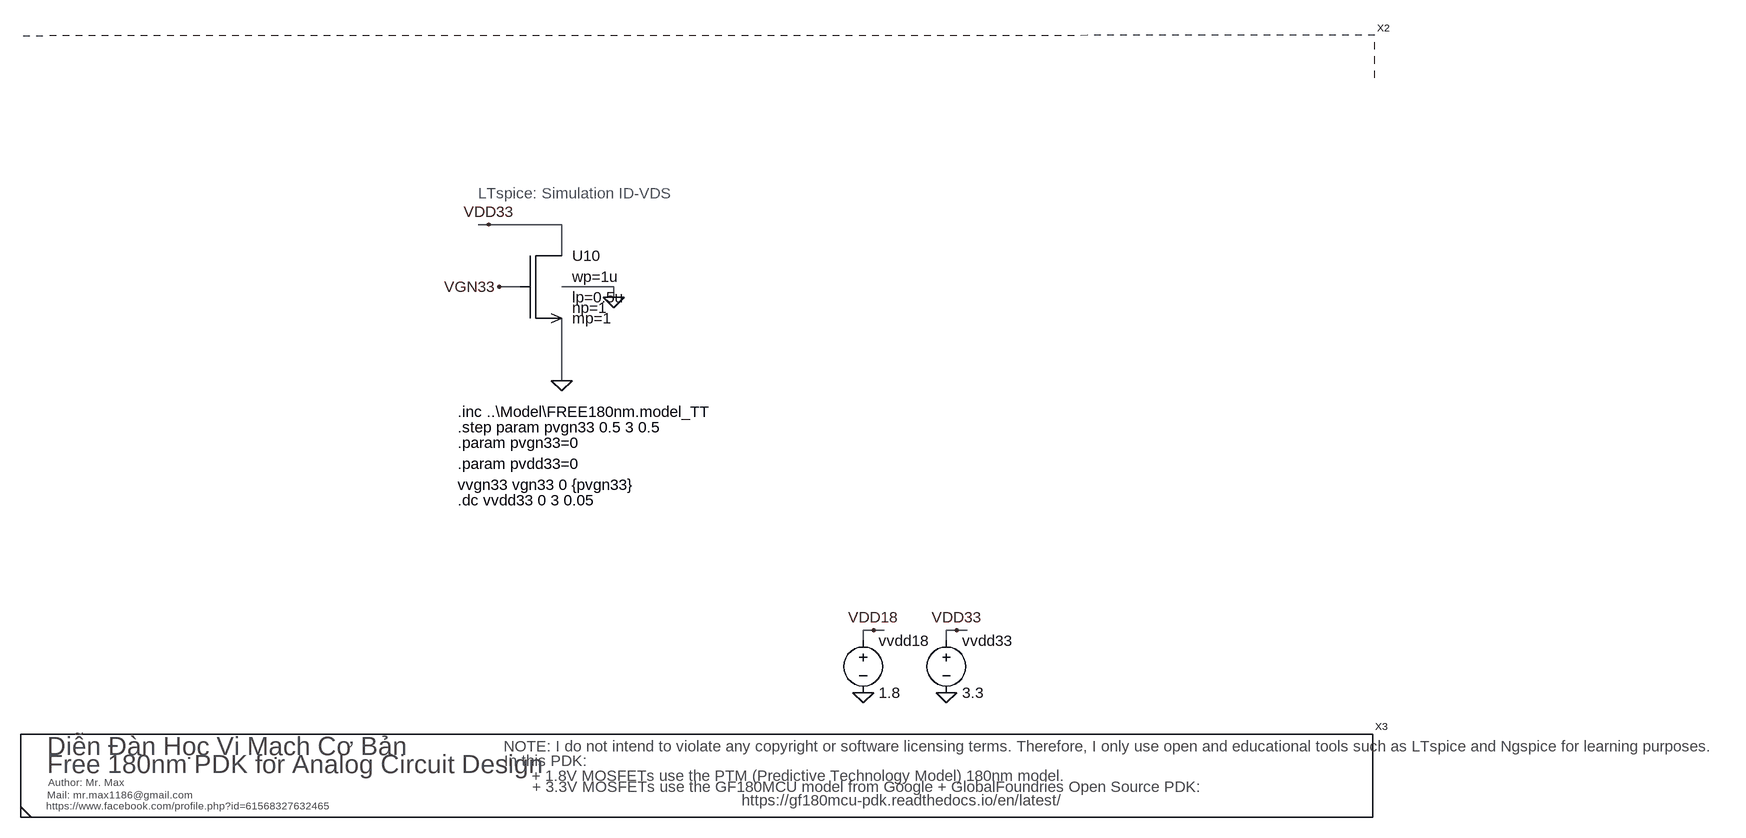
[diagram p0: schematic 03_Dev_idvds.asc]
03_Dev_idvds.asc, the LTspice schematic file:
Version 4
SHEET 1 3292 980
WIRE 304 -528 288 -528
WIRE 416 -528 304 -528
WIRE 416 -480 416 -528
WIRE 352 -432 320 -432
WIRE 496 -432 416 -432
WIRE 496 -416 496 -432
WIRE 416 -288 416 -384
WIRE 896 96 880 96
WIRE 912 96 896 96
WIRE 1024 96 1008 96
WIRE 1040 96 1024 96
WIRE 880 112 880 96
WIRE 1008 112 1008 96
FLAG 880 192 0
FLAG 1008 192 0
FLAG 1024 96 VDD33
FLAG 896 96 VDD18
FLAG 496 -416 0
FLAG 416 -288 0
FLAG 320 -432 VGN33
FLAG 304 -528 VDD33
SYMBOL voltage 880 96 R0
WINDOW 123 0 0 Left 2
WINDOW 39 0 0 Left 2
SYMATTR InstName vvdd18
SYMATTR Value 1.8
SYMBOL voltage 1008 96 R0
WINDOW 123 0 0 Left 2
WINDOW 39 0 0 Left 2
SYMATTR InstName vvdd33
SYMATTR Value 3.3
SYMBOL gfmcu_nmos3p3 352 -432 R0
SYMATTR InstName U10
SYMATTR Value wp=1u
SYMATTR Value2 lp=0.5u
SYMBOL BD_GTitleLTS -416 384 R0
SYMATTR InstName X3
SYMBOL header -416 -656 R0
SYMATTR InstName X2
TEXT 256 -192 Left 2 !.param pvgn33=0
TEXT 256 -216 Left 2 !.step param pvgn33 0.5 3 0.5
TEXT 256 -104 Left 2 !.dc vvdd33 0 3 0.05
TEXT 288 -576 Left 2 ;LTspice: Simulation ID-VDS
TEXT 256 -240 Left 2 !.inc ..\\Model\\FREE180nm.model_TT
TEXT 256 -160 Left 2 !.param pvdd33=0
TEXT 256 -128 Left 2 !vvgn33 vgn33 0 {pvgn33}

The netlist it stands for:
* 03_Dev_idvds.asc
vvdd18 VDD18 0 1.8
vvdd33 VDD33 0 3.3
XU10 VDD33 VGN33 0 0 gfmcu_nmos3p3 wp=1u lp=0.5u np=1 mp=1  ; pins ND NG NS NB
XX3 BD_GTitleLTS
XX2 header
.param pvgn33=0
.step param pvgn33 0.5 3 0.5
.dc vvdd33 0 3 0.05
* LTspice: Simulation ID-VDS
.inc ..\Model\FREE180nm.model_TT
.param pvdd33=0
vvgn33 vgn33 0 {pvgn33}
.lib FREE180nm.model
.backanno
.end

* Results of the author's LTspice run, read from the files saved beside the schematic
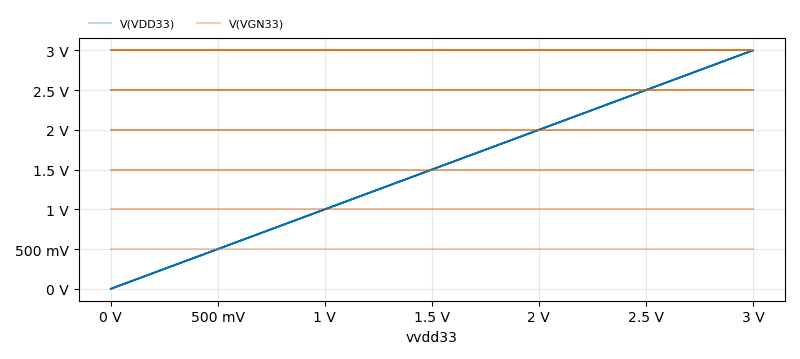
[diagram p1: DC transfer characteristic of 03_Dev_idvds.asc, plotted from the saved traces]
* DC transfer characteristic, 6 runs:
*   V(VDD33) [pvgn33=0.5]: 0 V at vvdd33=0 V, 3 V at vvdd33=3 V, min 0 V, max 3 V
*   V(VDD33) [pvgn33=1]: 0 V at vvdd33=0 V, 3 V at vvdd33=3 V, min 0 V, max 3 V
*   V(VDD33) [pvgn33=1.5]: 0 V at vvdd33=0 V, 3 V at vvdd33=3 V, min 0 V, max 3 V
*   V(VDD33) [pvgn33=2]: 0 V at vvdd33=0 V, 3 V at vvdd33=3 V, min 0 V, max 3 V
*   V(VDD33) [pvgn33=2.5]: 0 V at vvdd33=0 V, 3 V at vvdd33=3 V, min 0 V, max 3 V
*   V(VDD33) [pvgn33=3]: 0 V at vvdd33=0 V, 3 V at vvdd33=3 V, min 0 V, max 3 V
*   V(VGN33) [pvgn33=0.5]: 500 mV at vvdd33=0 V, 500 mV at vvdd33=3 V, min 500 mV, max 500 mV
*   V(VGN33) [pvgn33=1]: 1 V at vvdd33=0 V, 1 V at vvdd33=3 V, min 1 V, max 1 V
*   V(VGN33) [pvgn33=1.5]: 1.5 V at vvdd33=0 V, 1.5 V at vvdd33=3 V, min 1.5 V, max 1.5 V
*   V(VGN33) [pvgn33=2]: 2 V at vvdd33=0 V, 2 V at vvdd33=3 V, min 2 V, max 2 V
*   V(VGN33) [pvgn33=2.5]: 2.5 V at vvdd33=0 V, 2.5 V at vvdd33=3 V, min 2.5 V, max 2.5 V
*   V(VGN33) [pvgn33=3]: 3 V at vvdd33=0 V, 3 V at vvdd33=3 V, min 3 V, max 3 V